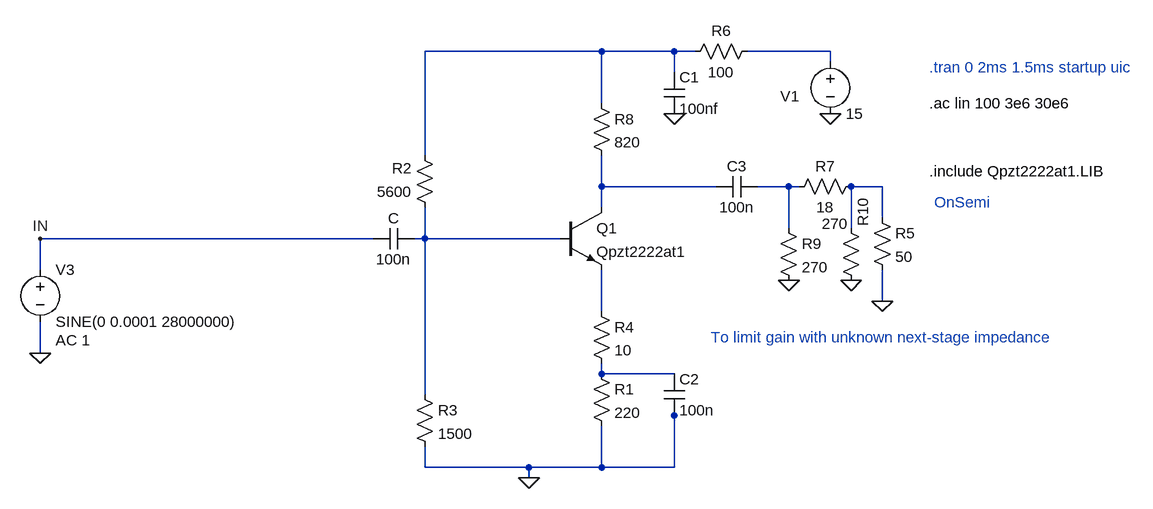
[diagram p0: schematic Single-Transistor-HF-LNA-2222-onsemi.asc]
Single-Transistor-HF-LNA-2222-onsemi.asc, the LTspice schematic file:
Version 4.1
SHEET 1 2344 2032
WIRE 1024 1072 752 1072
WIRE 1136 1072 1024 1072
WIRE 1168 1072 1136 1072
WIRE 1376 1072 1248 1072
WIRE 1376 1088 1376 1072
WIRE 1136 1104 1136 1072
WIRE 1024 1152 1024 1072
WIRE 752 1232 752 1072
WIRE 1024 1280 1024 1232
WIRE 1200 1280 1024 1280
WIRE 1312 1280 1264 1280
WIRE 1328 1280 1312 1280
WIRE 1456 1280 1408 1280
WIRE 1024 1312 1024 1280
WIRE 1456 1328 1456 1280
WIRE 1312 1344 1312 1280
WIRE 1408 1344 1408 1280
WIRE 672 1360 160 1360
WIRE 752 1360 752 1312
WIRE 752 1360 736 1360
WIRE 960 1360 752 1360
WIRE 160 1408 160 1360
WIRE 1456 1456 1456 1408
WIRE 1024 1472 1024 1408
WIRE 160 1536 160 1488
WIRE 1024 1568 1024 1552
WIRE 1136 1568 1024 1568
WIRE 752 1600 752 1360
WIRE 1136 1632 1136 1616
WIRE 752 1712 752 1680
WIRE 912 1712 752 1712
WIRE 1024 1712 1024 1648
WIRE 1024 1712 912 1712
WIRE 1136 1712 1136 1632
WIRE 1136 1712 1024 1712
WIRE 912 1728 912 1712
FLAG 160 1536 0
FLAG 160 1360 IN
FLAG 912 1728 0
FLAG 1376 1168 0
FLAG 1456 1456 0
FLAG 1136 1168 0
FLAG 1312 1424 0
FLAG 1408 1424 0
SYMBOL voltage 160 1392 R0
WINDOW 123 24 124 Left 2
WINDOW 39 0 0 Left 0
SYMATTR Value2 AC 1
SYMATTR InstName V3
SYMATTR Value SINE(0 0.0001 28000000)
SYMBOL cap 736 1344 R90
WINDOW 0 0 32 VBottom 2
WINDOW 3 32 32 VTop 2
SYMATTR InstName C
SYMATTR Value 100n
SYMBOL res 768 1328 R180
WINDOW 0 36 76 Left 2
WINDOW 3 36 40 Left 2
SYMATTR InstName R2
SYMATTR Value 5600
SYMBOL res 736 1584 R0
SYMATTR InstName R3
SYMATTR Value 1500
SYMBOL npn2 960 1312 R0
SYMATTR InstName Q1
SYMATTR Value Qpzt2222at1
SYMBOL VOLTAGE 1376 1072 R0
WINDOW 0 -77 69 Left 2
WINDOW 123 0 0 Left 0
WINDOW 39 0 0 Left 0
SYMATTR InstName V1
SYMATTR Value 15
SYMBOL res 1008 1552 R0
SYMATTR InstName R1
SYMATTR Value 220
SYMBOL cap 1120 1568 R0
SYMATTR InstName C2
SYMATTR Value 100n
SYMBOL cap 1264 1264 R90
WINDOW 0 0 32 VBottom 2
WINDOW 3 32 32 VTop 2
SYMATTR InstName C3
SYMATTR Value 100n
SYMBOL res 1440 1312 R0
SYMATTR InstName R5
SYMATTR Value 50
SYMBOL res 1008 1456 R0
SYMATTR InstName R4
SYMATTR Value 10
SYMBOL res 1264 1056 R90
WINDOW 0 0 56 VBottom 2
WINDOW 3 32 56 VTop 2
SYMATTR InstName R6
SYMATTR Value 100
SYMBOL cap 1120 1104 R0
SYMATTR InstName C1
SYMATTR Value 100nf
SYMBOL res 1008 1136 R0
SYMATTR InstName R8
SYMATTR Value 820
SYMBOL res 1424 1264 R90
WINDOW 0 0 56 VBottom 2
WINDOW 3 32 56 VTop 2
SYMATTR InstName R7
SYMATTR Value 18
SYMBOL res 1296 1328 R0
SYMATTR InstName R9
SYMATTR Value 270
SYMBOL res 1392 1328 R0
WINDOW 0 34 -31 VRight 2
WINDOW 3 -29 9 Left 2
SYMATTR InstName R10
SYMATTR Value 270
TEXT 1528 1096 Left 2 ;.tran 0 2ms 1.5ms startup uic
TEXT 1528 1152 Left 2 !.ac lin 100 3e6 30e6
TEXT 1528 1256 Left 2 !.include Qpzt2222at1.LIB
TEXT 1192 1512 Left 2 ;To limit gain with unknown next-stage impedance
TEXT 1536 1304 Left 2 ;OnSemi

The netlist it stands for:
* Single-Transistor-HF-LNA-2222-onsemi.asc
V3 IN 0 SINE(0 0.0001 28000000) AC 1
C N006 IN 100n
R2 N006 N001 5600
R3 N006 0 1500
Q1 N003 N006 N007 0 Qpzt2222at1
V1 N002 0 15
R1 N008 0 220
C2 N008 0 100n
C3 N004 N003 100n
R5 N005 0 50
R4 N007 N008 10
R6 N002 N001 100
C1 N001 0 100nf
R8 N001 N003 820
R7 N005 N004 18
R9 N004 0 270
R10 N005 0 270
.model NPN NPN
.model PNP PNP
.lib standard.bjt
* .tran 0 2ms 1.5ms startup uic
.ac lin 100 3e6 30e6
.include Qpzt2222at1.LIB
* To limit gain with unknown next-stage impedance
* OnSemi
.backanno
.end